# EAGLE schematic SmartBadge2 (EAGLE 9.1.3)
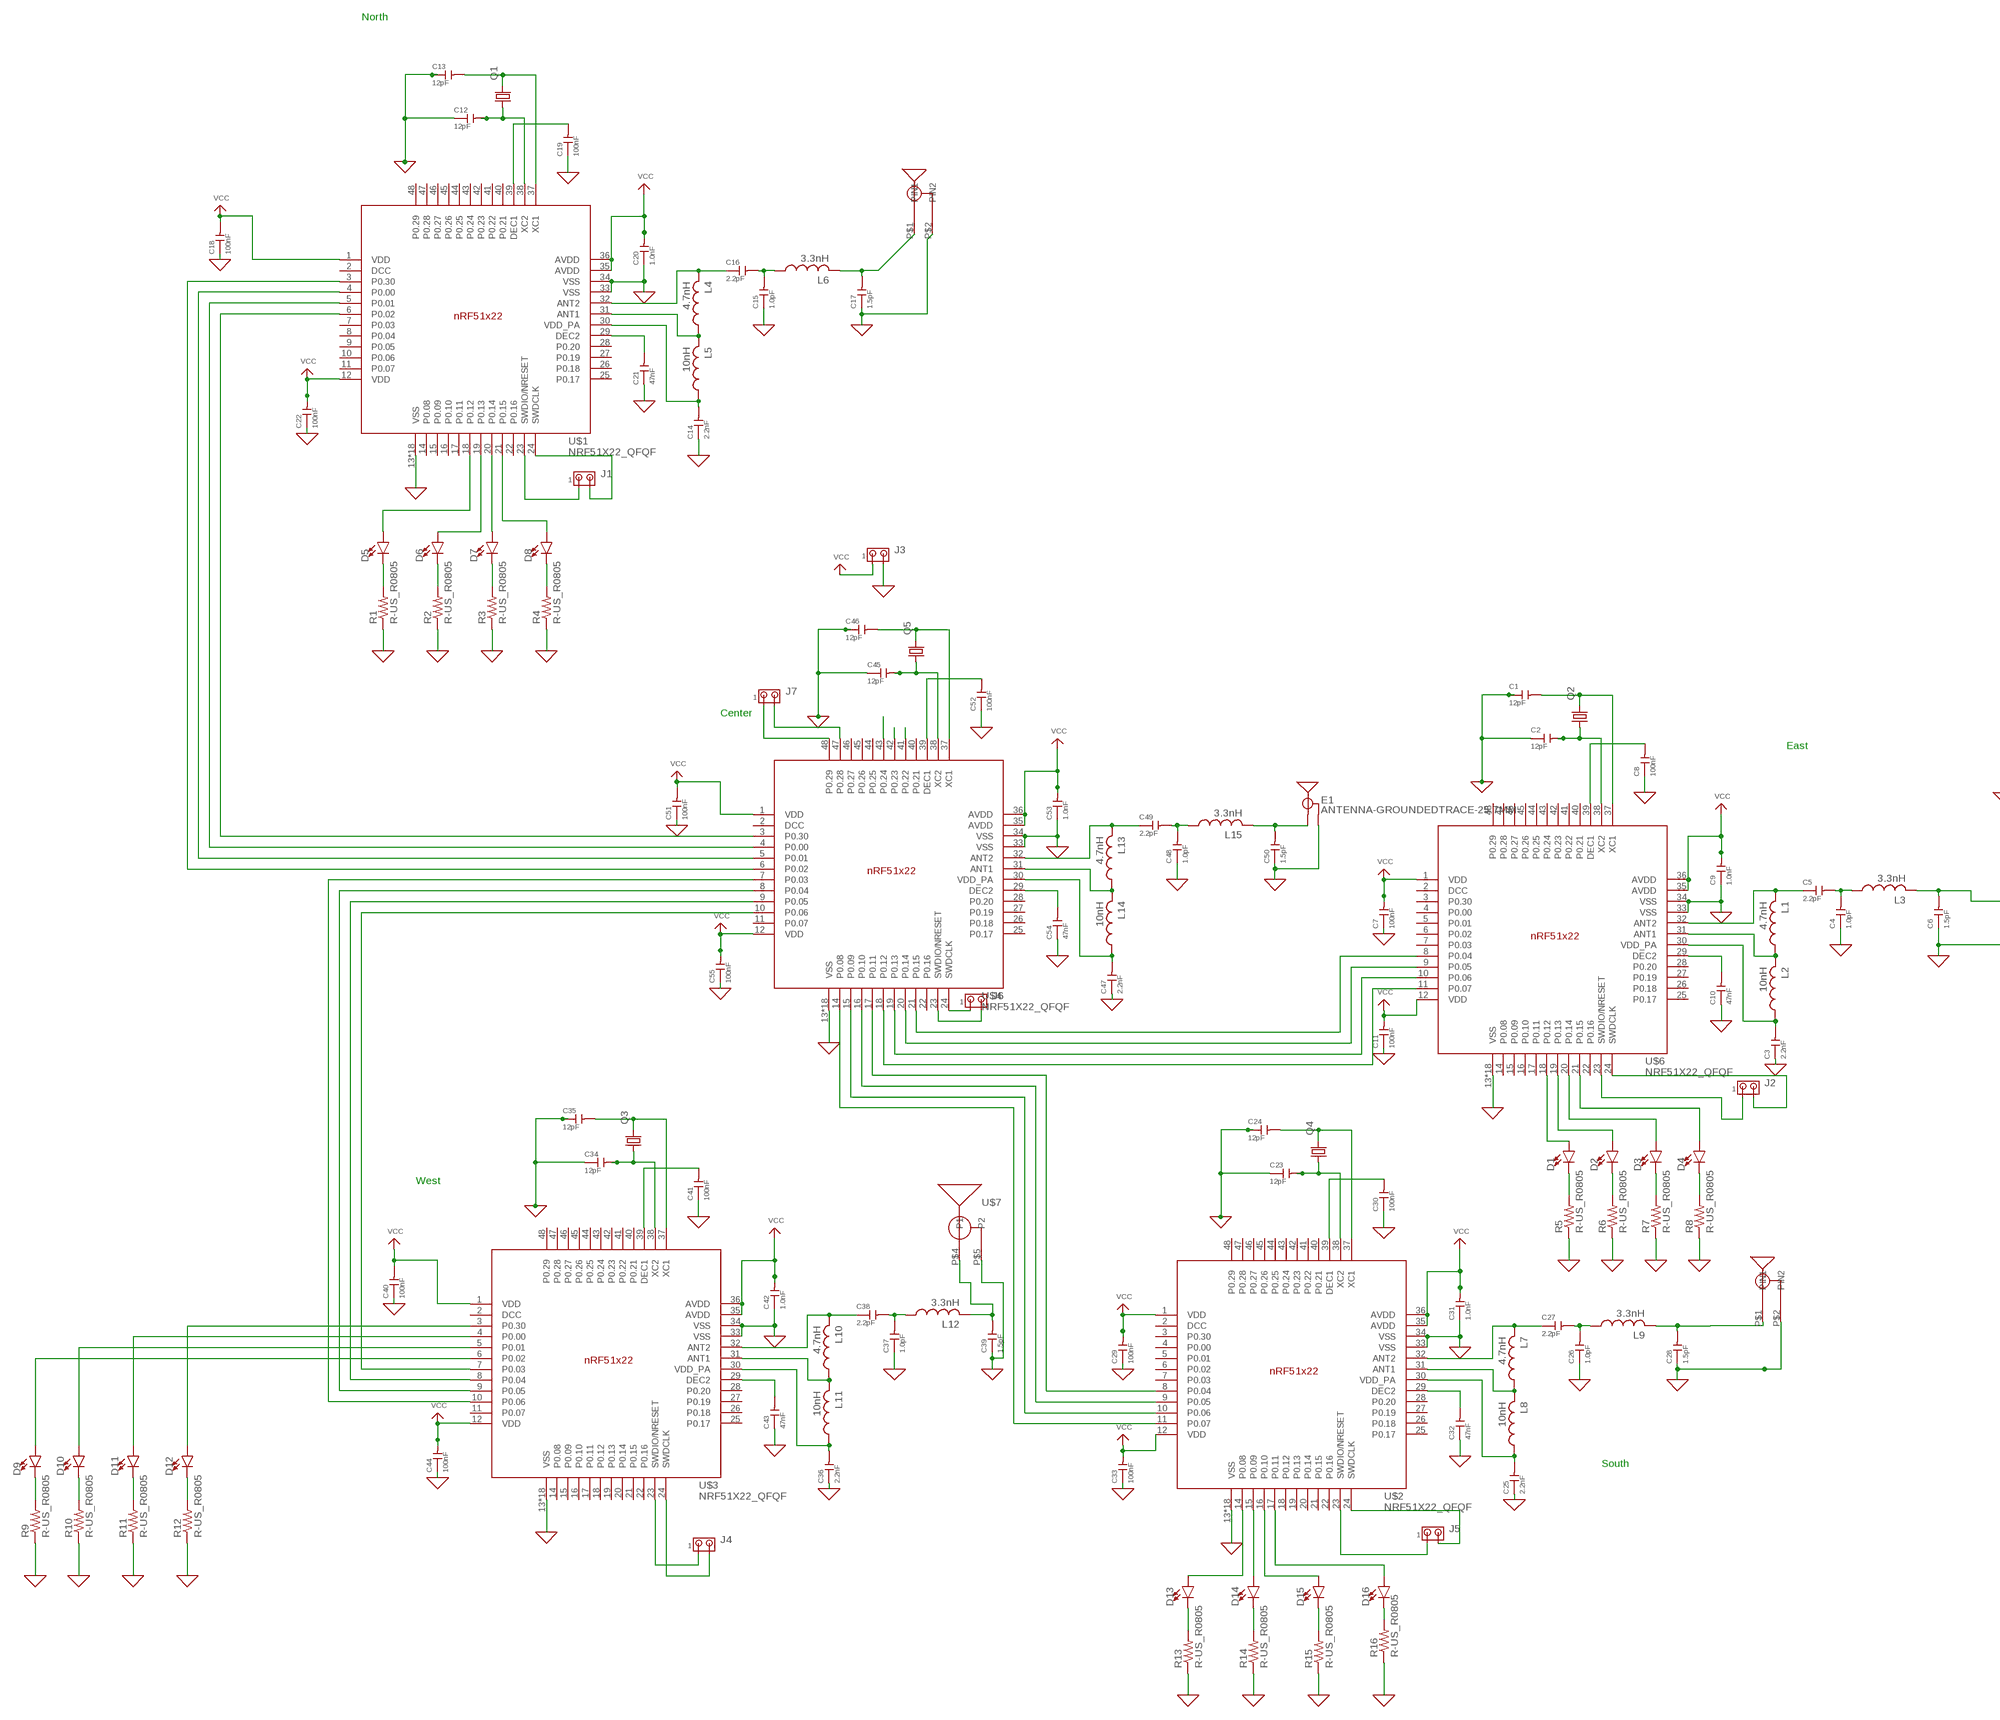
[diagram p0: schematic, sheet 1, part 1 of 2]
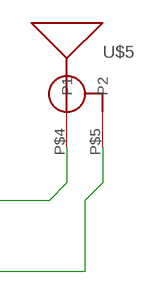
[diagram p1: schematic, sheet 1, part 2 of 2]

## Parts
C1  12pF  CERAMIC-22UF-6.3V-20%-X5R(0805)  [C0805]
C2  12pF  CERAMIC-22UF-6.3V-20%-X5R(0805)  [C0805]
C3  2.2nF  CERAMIC-22UF-6.3V-20%-X5R(0805)  [C0805]
C4  1.0pF  CERAMIC-22UF-6.3V-20%-X5R(0805)  [C0805]
C5  2.2pF  CERAMIC-22UF-6.3V-20%-X5R(0805)  [C0805]
C6  1.5pF  CERAMIC-22UF-6.3V-20%-X5R(0805)  [C0805]
C7  100nF  CERAMIC-22UF-6.3V-20%-X5R(0805)  [C0805]
C8  100nF  CERAMIC-22UF-6.3V-20%-X5R(0805)  [C0805]
C9  1.0nF  CERAMIC-22UF-6.3V-20%-X5R(0805)  [C0805]
C10  47nF  CERAMIC-22UF-6.3V-20%-X5R(0805)  [C0805]
C11  100nF  CERAMIC-22UF-6.3V-20%-X5R(0805)  [C0805]
C12  12pF  CERAMIC-22UF-6.3V-20%-X5R(0805)  [C0805]
C13  12pF  CERAMIC-22UF-6.3V-20%-X5R(0805)  [C0805]
C14  2.2nF  CERAMIC-22UF-6.3V-20%-X5R(0805)  [C0805]
C15  1.0pF  CERAMIC-22UF-6.3V-20%-X5R(0805)  [C0805]
C16  2.2pF  CERAMIC-22UF-6.3V-20%-X5R(0805)  [C0805]
C17  1.5pF  CERAMIC-22UF-6.3V-20%-X5R(0805)  [C0805]
C18  100nF  CERAMIC-22UF-6.3V-20%-X5R(0805)  [C0805]
C19  100nF  CERAMIC-22UF-6.3V-20%-X5R(0805)  [C0805]
C20  1.0nF  CERAMIC-22UF-6.3V-20%-X5R(0805)  [C0805]
C21  47nF  CERAMIC-22UF-6.3V-20%-X5R(0805)  [C0805]
C22  100nF  CERAMIC-22UF-6.3V-20%-X5R(0805)  [C0805]
C23  12pF  CERAMIC-22UF-6.3V-20%-X5R(0805)  [C0805]
C24  12pF  CERAMIC-22UF-6.3V-20%-X5R(0805)  [C0805]
C25  2.2nF  CERAMIC-22UF-6.3V-20%-X5R(0805)  [C0805]
C26  1.0pF  CERAMIC-22UF-6.3V-20%-X5R(0805)  [C0805]
C27  2.2pF  CERAMIC-22UF-6.3V-20%-X5R(0805)  [C0805]
C28  1.5pF  CERAMIC-22UF-6.3V-20%-X5R(0805)  [C0805]
C29  100nF  CERAMIC-22UF-6.3V-20%-X5R(0805)  [C0805]
C30  100nF  CERAMIC-22UF-6.3V-20%-X5R(0805)  [C0805]
C31  1.0nF  CERAMIC-22UF-6.3V-20%-X5R(0805)  [C0805]
C32  47nF  CERAMIC-22UF-6.3V-20%-X5R(0805)  [C0805]
C33  100nF  CERAMIC-22UF-6.3V-20%-X5R(0805)  [C0805]
C34  12pF  CERAMIC-22UF-6.3V-20%-X5R(0805)  [C0805]
C35  12pF  CERAMIC-22UF-6.3V-20%-X5R(0805)  [C0805]
C36  2.2nF  CERAMIC-22UF-6.3V-20%-X5R(0805)  [C0805]
C37  1.0pF  CERAMIC-22UF-6.3V-20%-X5R(0805)  [C0805]
C38  2.2pF  CERAMIC-22UF-6.3V-20%-X5R(0805)  [C0805]
C39  1.5pF  CERAMIC-22UF-6.3V-20%-X5R(0805)  [C0805]
C40  100nF  CERAMIC-22UF-6.3V-20%-X5R(0805)  [C0805]
C41  100nF  CERAMIC-22UF-6.3V-20%-X5R(0805)  [C0805]
C42  1.0nF  CERAMIC-22UF-6.3V-20%-X5R(0805)  [C0805]
C43  47nF  CERAMIC-22UF-6.3V-20%-X5R(0805)  [C0805]
C44  100nF  CERAMIC-22UF-6.3V-20%-X5R(0805)  [C0805]
C45  12pF  CERAMIC-22UF-6.3V-20%-X5R(0805)  [C0805]
C46  12pF  CERAMIC-22UF-6.3V-20%-X5R(0805)  [C0805]
C47  2.2nF  CERAMIC-22UF-6.3V-20%-X5R(0805)  [C0805]
C48  1.0pF  CERAMIC-22UF-6.3V-20%-X5R(0805)  [C0805]
C49  2.2pF  CERAMIC-22UF-6.3V-20%-X5R(0805)  [C0805]
C50  1.5pF  CERAMIC-22UF-6.3V-20%-X5R(0805)  [C0805]
C51  100nF  CERAMIC-22UF-6.3V-20%-X5R(0805)  [C0805]
C52  100nF  CERAMIC-22UF-6.3V-20%-X5R(0805)  [C0805]
C53  1.0nF  CERAMIC-22UF-6.3V-20%-X5R(0805)  [C0805]
C54  47nF  CERAMIC-22UF-6.3V-20%-X5R(0805)  [C0805]
C55  100nF  CERAMIC-22UF-6.3V-20%-X5R(0805)  [C0805]
D1  LED-GREEN0603  [LED-0603]
D2  LED-GREEN0603  [LED-0603]
D3  LED-GREEN0603  [LED-0603]
D4  LED-GREEN0603  [LED-0603]
D5  LED-GREEN0603  [LED-0603]
D6  LED-GREEN0603  [LED-0603]
D7  LED-GREEN0603  [LED-0603]
D8  LED-GREEN0603  [LED-0603]
D9  LED-GREEN0603  [LED-0603]
D10  LED-GREEN0603  [LED-0603]
D11  LED-GREEN0603  [LED-0603]
D12  LED-GREEN0603  [LED-0603]
D13  LED-GREEN0603  [LED-0603]
D14  LED-GREEN0603  [LED-0603]
D15  LED-GREEN0603  [LED-0603]
D16  LED-GREEN0603  [LED-0603]
E1  ANTENNA-GROUNDEDTRACE-25.7MM  [TRACE_ANTENNA_2.4GHZ_25.7MM]
J1  MTA02-100  [10X02MTA]
J2  MTA02-100  [10X02MTA]
J3  MTA02-100  [10X02MTA]
J4  MTA02-100  [10X02MTA]
J5  MTA02-100  [10X02MTA]
J6  MTA02-100  [10X02MTA]
J7  MTA02-100  [10X02MTA]
L1  4.7nH  INDUCTOR_0805_L  [RESC0805_L]
L2  10nH  INDUCTOR_0805_L  [RESC0805_L]
L3  3.3nH  INDUCTOR_0805_L  [RESC0805_L]
L4  4.7nH  INDUCTOR_0805_L  [RESC0805_L]
L5  10nH  INDUCTOR_0805_L  [RESC0805_L]
L6  3.3nH  INDUCTOR_0805_L  [RESC0805_L]
L7  4.7nH  INDUCTOR_0805_L  [RESC0805_L]
L8  10nH  INDUCTOR_0805_L  [RESC0805_L]
L9  3.3nH  INDUCTOR_0805_L  [RESC0805_L]
L10  4.7nH  INDUCTOR_0805_L  [RESC0805_L]
L11  10nH  INDUCTOR_0805_L  [RESC0805_L]
L12  3.3nH  INDUCTOR_0805_L  [RESC0805_L]
L13  4.7nH  INDUCTOR_0805_L  [RESC0805_L]
L14  10nH  INDUCTOR_0805_L  [RESC0805_L]
L15  3.3nH  INDUCTOR_0805_L  [RESC0805_L]
Q1  KX-6  [2.5X2.0_KX-6]
Q2  KX-6  [2.5X2.0_KX-6]
Q3  KX-6  [2.5X2.0_KX-6]
Q4  KX-6  [2.5X2.0_KX-6]
Q5  KX-6  [2.5X2.0_KX-6]
R1  R-US_R0805  [R0805]
R2  R-US_R0805  [R0805]
R3  R-US_R0805  [R0805]
R4  R-US_R0805  [R0805]
R5  R-US_R0805  [R0805]
R6  R-US_R0805  [R0805]
R7  R-US_R0805  [R0805]
R8  R-US_R0805  [R0805]
R9  R-US_R0805  [R0805]
R10  R-US_R0805  [R0805]
R11  R-US_R0805  [R0805]
R12  R-US_R0805  [R0805]
R13  R-US_R0805  [R0805]
R14  R-US_R0805  [R0805]
R15  R-US_R0805  [R0805]
R16  R-US_R0805  [R0805]
U$1  NRF51X22_QFQF  [QFN40P600X600X90-48_N]
U$2  NRF51X22_QFQF  [QFN40P600X600X90-48_N]
U$3  NRF51X22_QFQF  [QFN40P600X600X90-48_N]
U$4  NRF51X22_QFQF  [QFN40P600X600X90-48_N]
U$5  YAGI_UDA  [YAGIUDA]
U$6  NRF51X22_QFQF  [QFN40P600X600X90-48_N]
U$7  YAGI_UDA  [YAGIUDA]
U$8  2.4G_PATCH  [PATCH]
U$9  2.4G_PATCH  [PATCH]

## Nets
0: C1.1 C2.1 C3.1 C4.1 C6.1 C7.1 C8.1 C9.1 C10.1 C11.1 C12.1 C13.1 C14.1 C15.1 C17.1 C18.1 C19.1 C20.1 C21.1 C22.1 C23.1 C24.1 C25.1 C26.1 C28.1 C29.1 C30.1 C31.1 C32.1 C33.1 C34.1 C35.1 C36.1 C37.1 C39.1 C40.1 C41.1 C42.1 C43.1 C44.1 C45.1 C46.1 C47.1 C48.1 C50.1 C51.1 C52.1 C53.1 C54.1 C55.1 E1.GND E1.GND2(GND) J3.2 R1.1 R2.1 R3.1 R4.1 R5.1 R6.1 R7.1 R8.1 R9.1 R10.1 R11.1 R12.1 R13.1 R14.1 R15.1 R16.1 U$1.13(VSS) U$1.33(VSS) U$1.34(VSS) U$1.PAD(VSS) U$1.PAD@VIA01(VSS) U$1.PAD@VIA02(VSS) U$1.PAD@VIA03(VSS) U$1.PAD@VIA04(VSS) U$1.PAD@VIA05(VSS) U$1.PAD@VIA06(VSS) U$1.PAD@VIA07(VSS) U$1.PAD@VIA08(VSS) U$1.PAD@VIA09(VSS) U$1.PAD@VIA10(VSS) U$1.PAD@VIA11(VSS) U$1.PAD@VIA12(VSS) U$1.PAD@VIA13(VSS) U$1.PAD@VIA14(VSS) U$1.PAD@VIA15(VSS) U$1.PAD@VIA16(VSS) U$2.13(VSS) U$2.33(VSS) U$2.34(VSS) U$2.PAD(VSS) U$2.PAD@VIA01(VSS) U$2.PAD@VIA02(VSS) U$2.PAD@VIA03(VSS) U$2.PAD@VIA04(VSS) U$2.PAD@VIA05(VSS) U$2.PAD@VIA06(VSS) U$2.PAD@VIA07(VSS) U$2.PAD@VIA08(VSS) U$2.PAD@VIA09(VSS) U$2.PAD@VIA10(VSS) U$2.PAD@VIA11(VSS) U$2.PAD@VIA12(VSS) U$2.PAD@VIA13(VSS) U$2.PAD@VIA14(VSS) U$2.PAD@VIA15(VSS) U$2.PAD@VIA16(VSS) U$3.13(VSS) U$3.33(VSS) U$3.34(VSS) U$3.PAD(VSS) U$3.PAD@VIA01(VSS) U$3.PAD@VIA02(VSS) U$3.PAD@VIA03(VSS) U$3.PAD@VIA04(VSS) U$3.PAD@VIA05(VSS) U$3.PAD@VIA06(VSS) U$3.PAD@VIA07(VSS) U$3.PAD@VIA08(VSS) U$3.PAD@VIA09(VSS) U$3.PAD@VIA10(VSS) U$3.PAD@VIA11(VSS) U$3.PAD@VIA12(VSS) U$3.PAD@VIA13(VSS) U$3.PAD@VIA14(VSS) U$3.PAD@VIA15(VSS) U$3.PAD@VIA16(VSS) U$4.13(VSS) U$4.33(VSS) U$4.34(VSS) U$4.PAD(VSS) U$4.PAD@VIA01(VSS) U$4.PAD@VIA02(VSS) U$4.PAD@VIA03(VSS) U$4.PAD@VIA04(VSS) U$4.PAD@VIA05(VSS) U$4.PAD@VIA06(VSS) U$4.PAD@VIA07(VSS) U$4.PAD@VIA08(VSS) U$4.PAD@VIA09(VSS) U$4.PAD@VIA10(VSS) U$4.PAD@VIA11(VSS) U$4.PAD@VIA12(VSS) U$4.PAD@VIA13(VSS) U$4.PAD@VIA14(VSS) U$4.PAD@VIA15(VSS) U$4.PAD@VIA16(VSS) U$5.P$5(P2) U$6.13(VSS) U$6.33(VSS) U$6.34(VSS) U$6.PAD(VSS) U$6.PAD@VIA01(VSS) U$6.PAD@VIA02(VSS) U$6.PAD@VIA03(VSS) U$6.PAD@VIA04(VSS) U$6.PAD@VIA05(VSS) U$6.PAD@VIA06(VSS) U$6.PAD@VIA07(VSS) U$6.PAD@VIA08(VSS) U$6.PAD@VIA09(VSS) U$6.PAD@VIA10(VSS) U$6.PAD@VIA11(VSS) U$6.PAD@VIA12(VSS) U$6.PAD@VIA13(VSS) U$6.PAD@VIA14(VSS) U$6.PAD@VIA15(VSS) U$6.PAD@VIA16(VSS) U$7.P$5(P2) U$8.P$2(PIN2) U$9.P$2(PIN2) ; supply symbol labelled GND
N$1: C8.2 U$6.39(DEC1)
N$2: C1.2 Q2.3 U$6.37(XC1)
N$3: C10.2 U$6.29(DEC2)
N$4: C2.2 Q2.1 U$6.38(XC2)
N$5: C5.1 L1.2 U$6.32(ANT2)
N$6: L1.1 L2.2 U$6.31(ANT1)
N$7: C3.2 L2.1 U$6.30(VDD_PA)
N$8: C4.2 C5.2 L3.1
N$9: C6.2 L3.2 U$5.P$4(P1)
N$10: C13.2 Q1.3 U$1.37(XC1)
N$11: C12.2 Q1.1 U$1.38(XC2)
N$12: C19.2 U$1.39(DEC1)
N$13: C21.2 U$1.29(DEC2)
N$14: C16.1 L4.2 U$1.32(ANT2)
N$15: L4.1 L5.2 U$1.31(ANT1)
N$16: C14.2 L5.1 U$1.30(VDD_PA)
N$17: C15.2 C16.2 L6.1
N$18: C17.2 L6.2 U$8.P$1(PIN1)
N$19: C24.2 Q4.3 U$2.37(XC1)
N$20: C23.2 Q4.1 U$2.38(XC2)
N$21: C30.2 U$2.39(DEC1)
N$22: C32.2 U$2.29(DEC2)
N$23: C27.1 L7.2 U$2.32(ANT2)
N$24: L7.1 L8.2 U$2.31(ANT1)
N$25: C25.2 L8.1 U$2.30(VDD_PA)
N$26: C26.2 C27.2 L9.1
N$27: C28.2 L9.2 U$9.P$1(PIN1)
N$28: C35.2 Q3.3 U$3.37(XC1)
N$29: C34.2 Q3.1 U$3.38(XC2)
N$30: C41.2 U$3.39(DEC1)
N$31: C43.2 U$3.29(DEC2)
N$32: C38.1 L10.2 U$3.32(ANT2)
N$33: L10.1 L11.2 U$3.31(ANT1)
N$34: C36.2 L11.1 U$3.30(VDD_PA)
N$35: C37.2 C38.2 L12.1
N$36: C39.2 L12.2 U$7.P$4(P1)
N$37: C46.2 Q5.3 U$4.37(XC1)
N$38: C45.2 Q5.1 U$4.38(XC2)
N$39: C52.2 U$4.39(DEC1)
N$40: C54.2 U$4.29(DEC2)
N$41: C49.1 L13.2 U$4.32(ANT2)
N$42: L13.1 L14.2 U$4.31(ANT1)
N$43: C47.2 L14.1 U$4.30(VDD_PA)
N$44: C48.2 C49.2 L15.1
N$45: C50.2 E1.ANT(SIGNAL) L15.2
N$46: U$1.6(P0.02) U$4.3(P0.30)
N$47: U$1.5(P0.01) U$4.4(P0.00)
N$48: U$1.4(P0.00) U$4.5(P0.01)
N$49: U$1.3(P0.30) U$4.6(P0.02)
N$50: J6.2 U$4.23(SWDIO/NRESET)
N$51: U$4.41(P0.22)
N$52: U$4.42(P0.23)
N$53: U$4.43(P0.24)
N$54: U$3.7(P0.03) U$4.10(P0.06)
N$55: U$3.8(P0.04) U$4.9(P0.05)
N$56: U$3.9(P0.05) U$4.8(P0.04)
N$57: U$3.10(P0.06) U$4.7(P0.03)
N$58: U$2.8(P0.04) U$4.17(P0.11)
N$59: U$2.9(P0.05) U$4.16(P0.10)
N$60: U$2.10(P0.06) U$4.15(P0.09)
N$61: U$2.11(P0.07) U$4.14(P0.08)
N$62: D1.A U$6.18(P0.12)
N$63: D2.A U$6.19(P0.13)
N$64: D3.A U$6.20(P0.14)
N$65: D4.A U$6.21(P0.15)
N$66: D5.A U$1.18(P0.12)
N$67: D6.A U$1.19(P0.13)
N$68: D7.A U$1.20(P0.14)
N$69: D8.A U$1.21(P0.15)
N$70: D12.A U$3.3(P0.30)
N$71: D11.A U$3.4(P0.00)
N$72: D10.A U$3.5(P0.01)
N$73: D9.A U$3.6(P0.02)
N$74: D13.A U$2.14(P0.08)
N$75: D14.A U$2.15(P0.09)
N$76: D15.A U$2.16(P0.10)
N$77: D16.A U$2.17(P0.11)
N$78: D5.C R1.2
N$79: D6.C R2.2
N$80: D7.C R3.2
N$81: D8.C R4.2
N$82: D1.C R5.2
N$83: D2.C R6.2
N$84: D3.C R7.2
N$85: D4.C R8.2
N$86: D13.C R13.2
N$87: D14.C R14.2
N$88: D15.C R15.2
N$89: D16.C R16.2
N$90: D12.C R12.2
N$91: D11.C R11.2
N$92: D10.C R10.2
N$93: D9.C R9.2
N$94: U$4.21(P0.15) U$6.8(P0.04)
N$95: U$4.20(P0.14) U$6.9(P0.05)
N$96: J4.1 U$3.23(SWDIO/NRESET)
N$97: J4.2 U$3.24(SWDCLK)
N$98: J5.1 U$2.23(SWDIO/NRESET)
N$99: J5.2 U$2.24(SWDCLK)
N$102: J2.1 U$6.23(SWDIO/NRESET)
N$103: J2.2 U$6.24(SWDCLK)
N$104: J1.1 U$1.23(SWDIO/NRESET)
N$105: J1.2 U$1.24(SWDCLK)
N$106: J6.1 U$4.24(SWDCLK)
N$107: U$4.19(P0.13) U$6.10(P0.06)
N$108: U$4.18(P0.12) U$6.11(P0.07)
N$109: J7.1 U$4.48(P0.29)
N$110: J7.2 U$4.47(P0.28)
VCC: C7.2 C9.2 C11.2 C18.2 C20.2 C22.2 C29.2 C31.2 C33.2 C40.2 C42.2 C44.2 C51.2 C53.2 C55.2 J3.1 U$1.1(VDD) U$1.12(VDD) U$1.35(AVDD) U$1.36(AVDD) U$2.1(VDD) U$2.12(VDD) U$2.35(AVDD) U$2.36(AVDD) U$3.1(VDD) U$3.12(VDD) U$3.35(AVDD) U$3.36(AVDD) U$4.1(VDD) U$4.12(VDD) U$4.35(AVDD) U$4.36(AVDD) U$6.1(VDD) U$6.12(VDD) U$6.35(AVDD) U$6.36(AVDD)
Unconnected: U$1.7(P0.03) U$1.8(P0.04) U$1.9(P0.05) U$1.10(P0.06) U$1.11(P0.07) U$1.14(P0.08) U$1.15(P0.09) U$1.16(P0.10) U$1.17(P0.11) U$1.22(P0.16) U$1.25(P0.17) U$1.26(P0.18) U$1.27(P0.19) U$1.28(P0.20) U$1.40(P0.21) U$1.41(P0.22) U$1.42(P0.23) U$1.43(P0.24) U$1.44(P0.25) U$1.45(P0.26) U$1.46(P0.27) U$1.47(P0.28) U$1.48(P0.29) U$2.3(P0.30) U$2.4(P0.00) U$2.5(P0.01) U$2.6(P0.02) U$2.7(P0.03) U$2.18(P0.12) U$2.19(P0.13) U$2.20(P0.14) U$2.21(P0.15) U$2.22(P0.16) U$2.25(P0.17) U$2.26(P0.18) U$2.27(P0.19) U$2.28(P0.20) U$2.40(P0.21) U$2.41(P0.22) U$2.42(P0.23) U$2.43(P0.24) U$2.44(P0.25) U$2.45(P0.26) U$2.46(P0.27) U$2.47(P0.28) U$2.48(P0.29) U$3.11(P0.07) U$3.14(P0.08) U$3.15(P0.09) U$3.16(P0.10) U$3.17(P0.11) U$3.18(P0.12) U$3.19(P0.13) U$3.20(P0.14) U$3.21(P0.15) U$3.22(P0.16) U$3.25(P0.17) U$3.26(P0.18) U$3.27(P0.19) U$3.28(P0.20) U$3.40(P0.21) U$3.41(P0.22) U$3.42(P0.23) U$3.43(P0.24) U$3.44(P0.25) U$3.45(P0.26) U$3.46(P0.27) U$3.47(P0.28) U$3.48(P0.29) U$4.11(P0.07) U$4.22(P0.16) U$4.25(P0.17) U$4.26(P0.18) U$4.27(P0.19) U$4.28(P0.20) U$4.40(P0.21) U$4.44(P0.25) U$4.45(P0.26) U$4.46(P0.27) U$6.3(P0.30) U$6.4(P0.00) U$6.5(P0.01) U$6.6(P0.02) U$6.7(P0.03) U$6.14(P0.08) U$6.15(P0.09) U$6.16(P0.10) U$6.17(P0.11) U$6.22(P0.16) U$6.25(P0.17) U$6.26(P0.18) U$6.27(P0.19) U$6.28(P0.20) U$6.40(P0.21) U$6.41(P0.22) U$6.42(P0.23) U$6.43(P0.24) U$6.44(P0.25) U$6.45(P0.26) U$6.46(P0.27) U$6.47(P0.28) U$6.48(P0.29)

## Notes on the sheet
- North
- Center
- East
- West
- South

## Power pins joined to a net without a drawn wire
DCC: U$1.2(DCC) U$2.2(DCC) U$3.2(DCC) U$4.2(DCC) U$6.2(DCC)

## Library data of the parts
C1-C55 = Seeed-Capacitor:CERAMIC-22UF-6.3V-20%-X5R(0805): 302010171; MPN: CC0805MKX5R5BB226; VALUE: 22uf
D1-D16 = SparkFun-LED:LED-GREEN: Green SMD LED Used in manufacturing of various products at SparkFun Packages: 0603 - SMD 0603 package [Product Link] <http://www.futureelectronics.com/en/technologies/semiconductors/optoelectronics/leds/Pages/9894312-LTST-C190GKT.aspx?CrossPart=HSMG-C190&IM=0> LilyPad 1206 - SMD1206 LilyPad package [Product Link] <http://www.futureelectronics.com/en/Technologies/Product.aspx?ProductID=IN150NGHARVATEKCORPORATION2049943&IM=0> 1206 - SMD1206 package [Product Link] <http://www.futureelectronics.com/en/technologies/semiconductors/optoelectronics/leds/Pages/8315665-LTST-C150KGKT.aspx?IM=0> 1206 Bottom Mount -SMD 1206 Bottom Mount [Product Link] <http://www.digikey.com/product-detail/en/lite-on-inc/LTST-C230KGKT/160-1456-1-ND/386854> SparkFun Products: Pro Mini 328 -5V <https://www.sparkfun.com/products/821> RedBoard <https://www.sparkfun.com/products/12757> MP3 Trigger <https://www.sparkfun.com/products/13720> Makey Makey <https://www.sparkfun.com/products/11076>; PROD_ID: DIO-00821; VALUE: GREEN
E1 = SparkFun-RF:ANTENNA-GROUNDED: Antenna w/ Ground Connection 2.4GHz antennae with signal and ground terminals. TRACE_ANTENNA_2.4GHZ_15.2MM - Meander Trace antenna 15.2 x 5.7mm footprint Based on layout from TI app note AN043 <http://www.ti.com/lit/an/swra117d/swra117d.pdf>. TRACE_ANTENNA_2.4GHZ_25.7MM - Inverted F trace antenna 25.7 x 7.5 mm footprint. Based on layout from TI design note DN0007 <http://www.ti.com/lit/an/swru120b/swru120b.pdf>.
J1-J7 = con-amp:MTA02-100: AMP connector
L1-L15 = Nordic_nRF:INDUCTOR: Generic chip inductor
Q1-Q5 = crystal-geyer_V1_0:KX: Quartz Crystals (MHz) SMD: KX - Serie Model Size l/w/h [mm] Frequency Range Frequency Stability Temp. Range [°C] Load Capacitance AECQ 200 availabel Datasheet KX-4 KX-5 KX-6 KX-7 KX-9A KX-9B KX-12A KX-12B KX-13 KX-20 KX-K KX-KS 1.6/1.2/0.3 2.0/1.6/0.45 2.5/2.0/0.55 3.2/2.5/0.8 5.0/3.2/1.0 5.0/3.2/1.1 6.0/3.5/1.1 6.0/3.5/1.0 7.0/5.0 /1.3 11.6/5.5/1.6 12.3/4.5/4.2 12.3/4.5/3.2 24.0 ~ 80.0 MHz 16.0 ~ 80.0 MHz 12.0 ~ 80.0 MHz 8.0 ~ 60.0 MHz 7,68 ~ 300,0 MHz 8,0 ~ 50,0 MHz 8,0 ~ 150,0 MHz 8,0 ~ 50,0 MHz 6,0 ~ 160,0 MHz 3,579 ~ 25,0 MHz 3,579 ~ 70,0 MHz 3,579 ~ 70,0 MHz ±10 … ±50ppm ±10 … ±50ppm ±10 … ±50ppm ±10 … ±50ppm ±10 … ±50ppm ±10 … ±50ppm ±10 … ±50ppm ±10 … ±50ppm ±10 … ±50ppm ±50ppm ±10 … ±50ppm ±10 … ±50ppm (*) -40°C …+85°C (*) -40°C …+125°C (*) -40°C …+125°C (*) -40°C …+125°C (*) -40°C …+105°C (*) -40°C …+105°C (*) -40°C …+125°C (*) -40°C …+105°C (*) -40°C …+105°C (*) -40°C …+105°C (*) -40°C …+85°C (*) -40°C …+85°C 8, 8…16 8, 8…16 10, 8…16 12, 7…20 16, 10…20 16, 10…20 16, 10…20 16, 12…20 16, 12…20 16, 12…20 16, 12…30 16, 12…30 - yes yes yes - - - - - - - - KX-4.pdf <http://www.geyer-electronic.de/uploads/tx_userartikelfrequenz/GEYER-KX-4.pdf> KX-5.pdf <http://www.geyer-electronic.de/uploads/tx_userartikelfrequenz/GEYER-KX-5.pdf> KX-6.pdf <http://www.geyer-electronic.de/uploads/tx_userartikelfrequenz/GEYER-KX-6.pdf> KX-7.pdf <http://www.geyer-electronic.de/uploads/tx_userartikelfrequenz/GEYER-KX-7.pdf> KX-9A.pdf <http://www.geyer-electronic.de/uploads/tx_userartikelfrequenz/GEYER-KX-9A.pdf> KX-9B.pdf <http://www.geyer-electronic.de/uploads/tx_userartikelfrequenz/GEYER-KX-9B.pdf> KX-12A.pdf <http://www.geyer-electronic.de/uploads/tx_userartikelfrequenz/GEYER-KX-12A.pdf> KX-12B.pdf <http://www.geyer-electronic.de/uploads/tx_userartikelfrequenz/GEYER-KX-12B.pdf> KX-13.pdf <http://www.geyer-electronic.de/uploads/tx_userartikelfrequenz/GEYER-KX-13.pdf> KX-20.pdf <http://www.geyer-electronic.de/uploads/tx_userartikelfrequenz/GEYER-KX-20.pdf> KX-K.pdf <http://www.geyer-electronic.de/uploads/tx_userartikelfrequenz/GEYER-KX-K.pdf> KX-KS.pdf <http://www.geyer-electronic.de/uploads/tx_userartikelfrequenz/GEYER-KX-KS.pdf> <http://www.geyer-electronic.de/fileadmin/template/img/logo-geyer-electronic.png> Details see: http://www.geyer-electronic.de/Frequenz-Produkte.9.0.html Created 2016-06-07, Hans Locher 2016 (C) Geyer Quartz Technology KX4,KX5,KX6,KX7,KX9A,KX9B,KX12A,KX12B,KX13,KX20,KXK,KXKS;1612;2016;2520;3225;5032;6035;7050;11655;12345;1,6x1,2;2,0x1,6;2,5x2,0;3,2x2,5;5,0x3,2;6,0x3,5;7,0x5,0;11,6x5,5;12,3x4,5;12,3x4,5;1.6x1.2;2.0x1.6;2.5x2.0;3.2x2.5;5.0x3.2;6.0x3.5;7.0x5.0;11.6x5.5;12.3x4.5;12.3x4.5;
R1-R16 = audio amplifier example:R-US_: RESISTOR, American symbol
U$1-U$4 U$6 = Nordic_nRF:NRF51X22_QF: nRF51x22 For devices: nRF51422 nRF51822 Features Single chip, highly flexible, 2.4 GHz multi-protocol device 32-bit ARM Cortex M0 CPU core 256kB/128kB flash + 32kB/16kB RAM Supports Bluetooth low energy protocol stacks Thread safe and run-time protected Event driven API On air compatible with nRF24L series 3 data rates (2Mbps/1Mbps/250kbps) +4dBm output power -93dBm sensitivity, Bluetooth low energy PPI system for maximum power-efficient applications and code simplification Flexible power management system with automatic power management of each peripheral Configurable I/O mapping for analog and digital I/O Applications Mobile phone accessories Wearables Beacons Rezence wireless charging monitoring PC peripherals Consumer Electronics (CE) remote controls Proximity/Alert sensors Smart Home Sports, fitness and healthcare sensors Smart RF tags Toys and electronic games Intelligent domestic appliances Industrial and commercial sensors Lighting
U$5 U$7 = Myown:YAGI_UDA
U$8 U$9 = Patch:2.4G_PATCH